# Altium schematic sheet Transmitter Suface.SchDoc
size A3; SheetNumber: 1; SheetTotal: 1
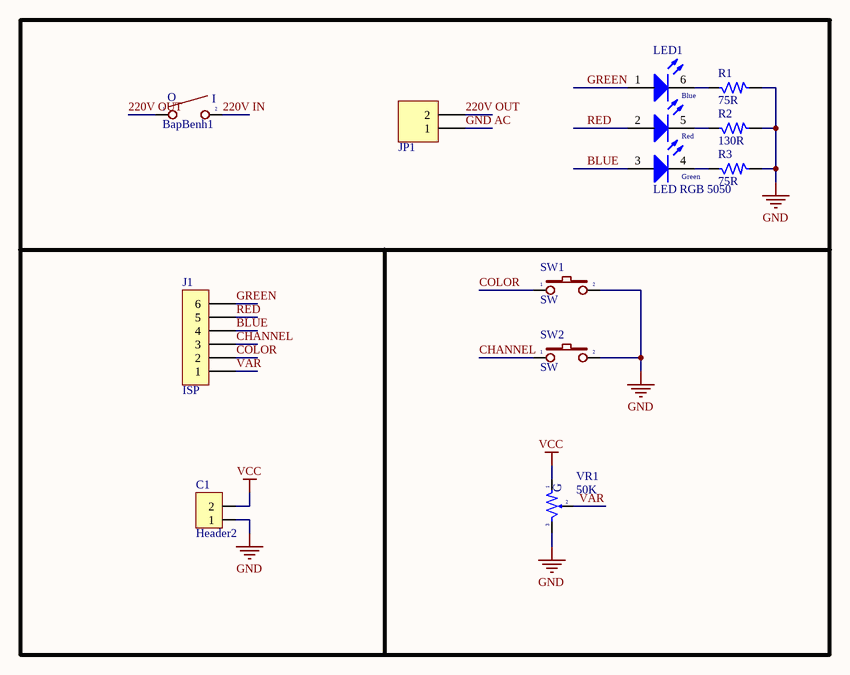
[diagram p0: Transmitter Suface.SchDoc]

## Parts
BapBenh1  BapBenh  [CONG TAC]  (value not drawn)
C1  Header2  [HDR2]
J1  ISP  [Header6]
JP1  Header 2_1  [HED2]  (value not drawn)
LED1  LED RGB 5050  [LED RGB 5050]
R1  75R  [RES-SMD-0805]
R2  130R  [RES-SMD-0805]
R3  75R  [RES-SMD-0805]
SW1  SW  [SW2]
SW2  SW  [SW2]
VR1  50K  [VR-S1 - CONG]

## Nets
GND: C1.1 R1.2 R2.2 R3.2 SW1.2 SW2.2 VR1.3
VCC: C1.2 VR1.1
220V IN: BapBenh1.2
220V OUT: BapBenh1.1 JP1.2
BLUE: J1.4 LED1.3
CHANNEL: J1.3 SW2.1
COLOR: J1.2 SW1.1
GND AC: JP1.1
GREEN: J1.6 LED1.1
RED: J1.5 LED1.2
VAR: J1.1 VR1.2
NetLED1_4: LED1.4 R3.1
NetLED1_5: LED1.5 R2.1
NetLED1_6: LED1.6 R1.1

## Notes on the sheet
- (in symbol BapBenh) O; I
- (in symbol LED RGB 5050) Blue; Red; Green
- (in symbol VR-S) G

## Library data of the parts
BapBenh1 = BapBenh: Value: SW chip 2 pin
C1 = Header2: Header IDC, 2 x 1 Pin Vertical 2.54mm Pitch (Non-Boxed, Male); Manufacturer: W¨¹rth Elektronik eiSos GmbH; partNo: 613002143121; ComponentLink1 Description: Manufacturer; ComponentLink2 Description: Datasheet; NoPins: 02; Created Date: 29 March 2013; ComponentLink1URL: http://www.we-online.com; ComponentLink2URL: http://katalog.we-online.de/em/datasheet/6130xx143121.pdf; Created by: Karrer Zheng
J1 = JUMP 6: JUMP DON DUC 2.54
JP1 = Header 2_1: Header, 2-Pin; Manufacturer: Generic Components; Class: Connector; Value: Header 2
LED1 = LED RGB 5050: PartNo: 150141M173100; Manufacturer: Würth Elektronik eiSos GmbH; Color: Red & Green & Blue; ComponentLink1Description: Manufacturer; ComponentLink1URL: http://www.we-online.de; Created by: Christin Otto; Created Date: June 2013; ComponentLink2Description: Datasheet; ComponentLink2URL: http://katalog.we-online.com/led/datasheet/150141M173100.pdf
R1-R3 = RES 1/4W: Tro 1/4W; Value: R1/4W - 1K
SW1 SW2 = SW2: Switch button 2 pin; Value: SW chip 2 pin
VR1 = VR-S: Var Resistor; Value: Volume 50k